# Altium schematic sheet SenSorBoard.SchDoc
size A
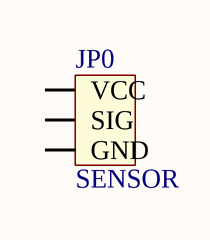
[diagram p0: SenSorBoard.SchDoc]

## Parts
JP0  SENSOR  [CON3]

## Nets

Not connected (* = marked no-connect by the designer): JP0 1(VCC) 2(SIG) 3(GND)

## Library data of the parts
JP0 = Con3: Connector 3; Value: Connector 3